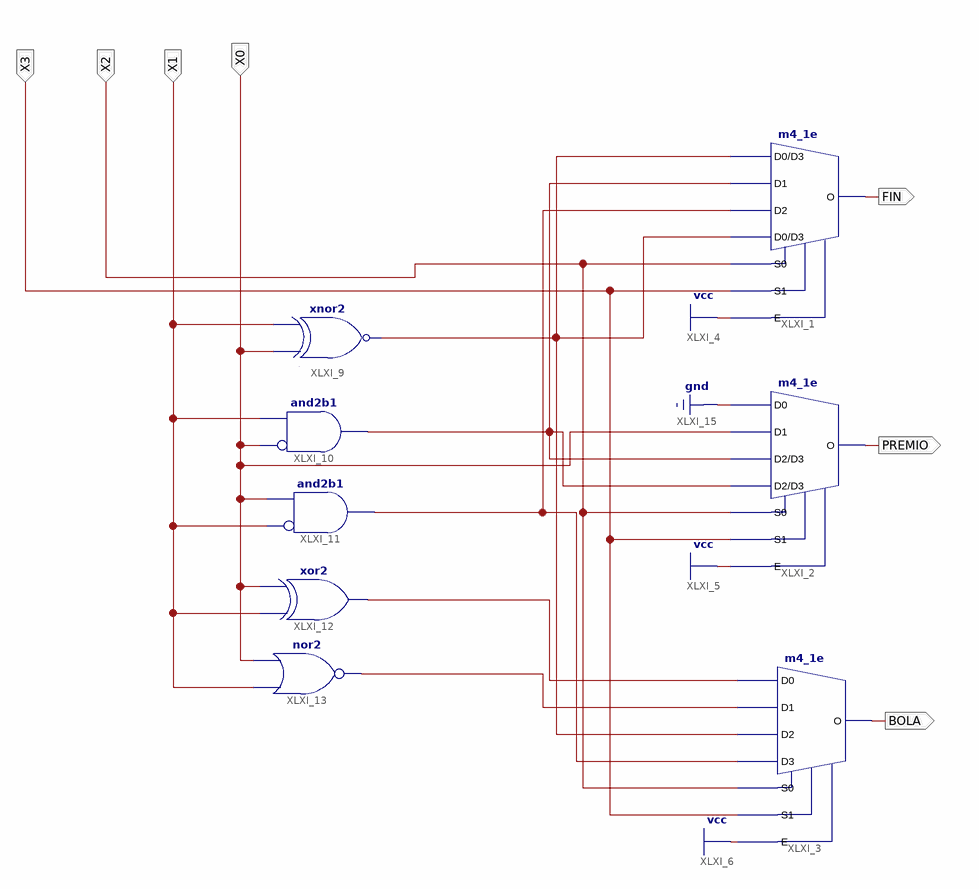
[diagram p0: schematic sheet 1]
// Xilinx ISE schematic p2ej2.sch (spartan3) as structural Verilog: 8 symbols, 7 ports
module p2ej2 (
  input  X2,
  input  X3,
  input  X1,
  input  X0,
  output FIN,
  output PREMIO,
  output BOLA
);

  wire XLXN_44, XLXN_46, XLXN_47, XLXN_51, XLXN_52;

  m4_1e XLXI_1 (.D0(XLXN_44), .D1(XLXN_46), .D2(XLXN_47), .D3(XLXN_44), .E(1'b1), .S0(X2), .S1(X3), .O(FIN));
  m4_1e XLXI_2 (.D0(1'b0), .D1(X0), .D2(XLXN_46), .D3(XLXN_46), .E(1'b1), .S0(X2), .S1(X3), .O(PREMIO));
  m4_1e XLXI_3 (.D0(XLXN_51), .D1(XLXN_52), .D2(XLXN_44), .D3(XLXN_47), .E(1'b1), .S0(X2), .S1(X3), .O(BOLA));
  xnor XLXI_9 (XLXN_44, X0, X1);
  and XLXI_10 (XLXN_46, ~X0, X1);  // and2b1
  and XLXI_11 (XLXN_47, ~X1, X0);  // and2b1
  xor XLXI_12 (XLXN_51, X1, X0);
  nor XLXI_13 (XLXN_52, X1, X0);
endmodule
